# EAGLE design CustComp_1.1 (EAGLE 9.2.2)
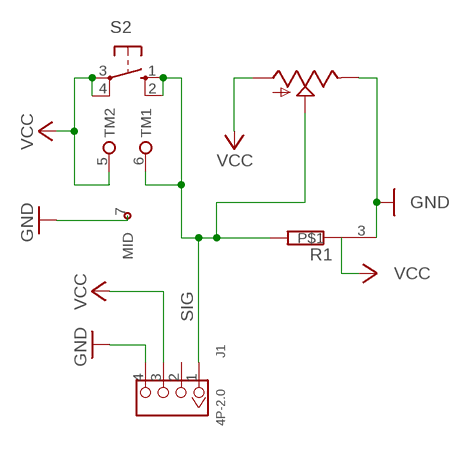
[diagram p0: schematic, sheet 1]

## Parts
J1  4P-2.0  GROVE-CONNECTOR-DIP(4P-2.0)  [HW4-2.0]
R1  RES_PULL_UP_DOWNRES_PULL_UP_DOWN_ANGLE  [RES_PULL_UP_DOWN_ANGLE]
S2  TERMINAL_TAC_SWITCHTERMINAL3.81_TAC12-PTH  [TERMINAL3.81_TAC12-PTH]
U$1  SPARKFUN_POT  [SPARKFUN_ALPS_POT]

## Nets
GND: J1.4 R1.3 S2.7(MID) U$1.P$1(E)
SIG: J1.1 R1.1 S2.1 S2.2 S2.6(TM1) U$1.P$2(S)
VCC: J1.3 R1.2 S2.3 S2.4 S2.5(TM2) U$1.P$3(A)
Unconnected: J1.2

## Library data of the parts
J1 = OPL_Connector:GROVE-CONNECTOR-DIP(4P-2.0): 320110033
R1 = StudioLab_Grove:RES_PULL_UP_DOWN: RESISTOR, European symbol
S2 = StudioLab_Grove:TERMINAL_TAC_SWITCH: Momentary Switch Button commonly used for reset or general input. Spark Fun Electronics SKU : COM-00097
U$1 = StudioLab_Grove:SPARKFUN_POT

## Board
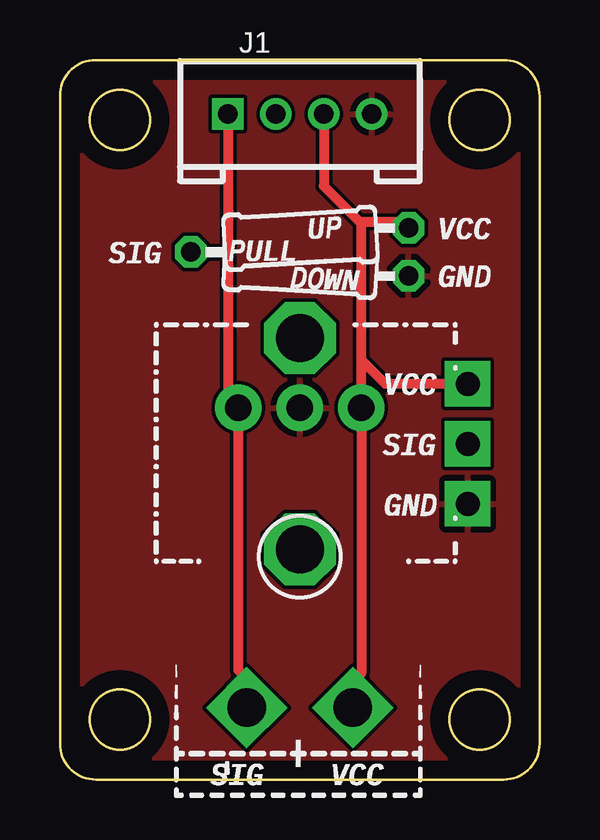
[diagram p1: board, top side]
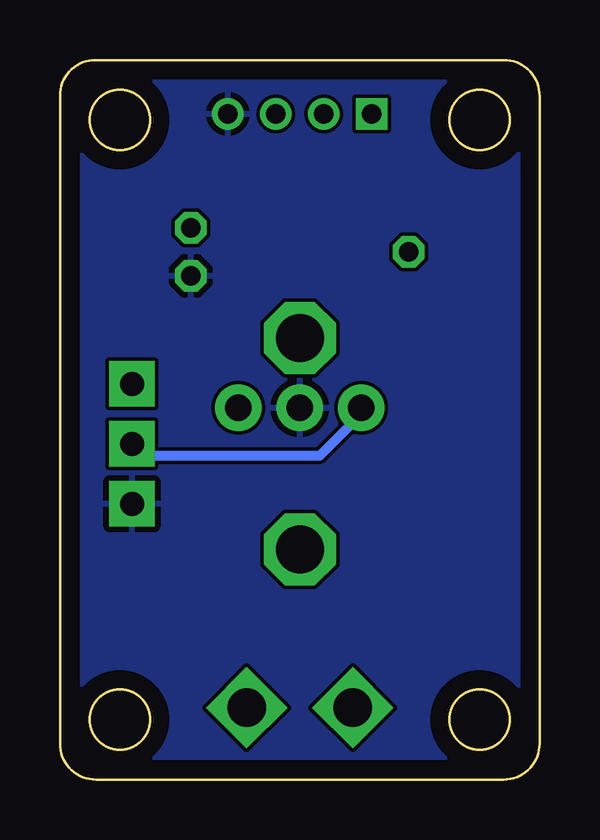
[diagram p2: board, bottom side, seen from below]

Size 20 x 30 mm. Coordinates in mm from the lower left corner, seen from the top.
Outline: 1.5,30 arc90 0,28.5 0,1.5 arc90 1.5,0 18.5,0 arc90 20,1.5 20,28.5 arc90 18.5,30 1.5,30
Outline: circle at 2.5,27.5 radius 1.25
Outline: circle at 17.5,27.5 radius 1.25
Outline: circle at 2.5,2.5 radius 1.25
Outline: circle at 17.5,2.5 radius 1.25
Copper layers (1*16): Top 0.035mm / dielectric 1.5mm / Bottom 0.035mm
Design rules "default *": minimum track width 6mil, minimum drill 0.35mm, track to track 6mil, track to pad 0.5mm, pad to pad 0.5mm, via to via 6mil, smd to smd 6mil, copper to edge 30mil, drill to drill 6mil, minimum pad ring 10mil, minimum via ring 8mil, stop-mask expansion 4mil, vias tented up to drill 35mil, thermal gap 10mil

### Footprints (pad centres in the part's own frame; a part is rotated, then mirrored left to right if it is on the bottom)
HW4-2.0 = drill 0.8 pad 1.27 square: 1 -3,0 | drill 0.8 pad 1.27: 2 -1,0; 3 1,0; 4 3,0
RES_PULL_UP_DOWN_ANGLE = drill 0.813 octagon: 1 -4.54,0; 2 4.54,1; 3 4.54,-1
TERMINAL3.81_TAC12-PTH = drill 1.6 pad 2.2 square: 1 -3.75,2.211; 3 -3.75,-2.211 | drill 1.1 pad 1.94: 2 8.75,2.562; 4 8.75,-2.562; 7 8.75,0 | smd 0.305 x 0.152: 5 -2.625,-2.25; 6 -2.625,2.125
SPARKFUN_ALPS_POT = drill 1 pad 1.88 square: P$1 7,-2.5; P$2 7,0; P$3 7,2.5 | drill 2 pad 2.8 octagon: P$4 0,-4.4; P$5 0,4.4

### Placement (x,y rotation side)
J1  10,27.75 0 top
R1  10,22 0 top
S2  10,6.75 90 top
U$1  10,14 0 top

### Tracks (layer width: path | path; a pad name or v marks a point on that pad's centre or on a via)
GND
  pour Top: 0,30 20,30 20,0 0,0
  pour Bottom: -0.5,30.5 20.5,30.5 20.5,-0.5 -0.5,-0.5
SIG
  Top 0.406: J1.1 7,22 | 7,22 7,15.94 S2.2 7.44,4.56 S2.6 7.79,4.04 S2.1 | R1.1 7,22
  Bottom 0.406: U$1.P$2 17,13.5 9.19,13.5 7.44,15.25 S2.2
VCC
  Top 0.406: 12.52,23.23 11,24.75 J1.3 | R1.2 14.31,23.23 12.52,23.23 | 12.52,23.23 12.54,23.25 12.56,23.23 12.56,17.5 | 12.56,17.5 S2.4 12.56,4.44 S2.5 12.21,4.09 S2.3 | U$1.P$3 13.56,16.5 12.56,17.5